# Altium schematic sheet SchematicEdwarda.SchDoc
size A4
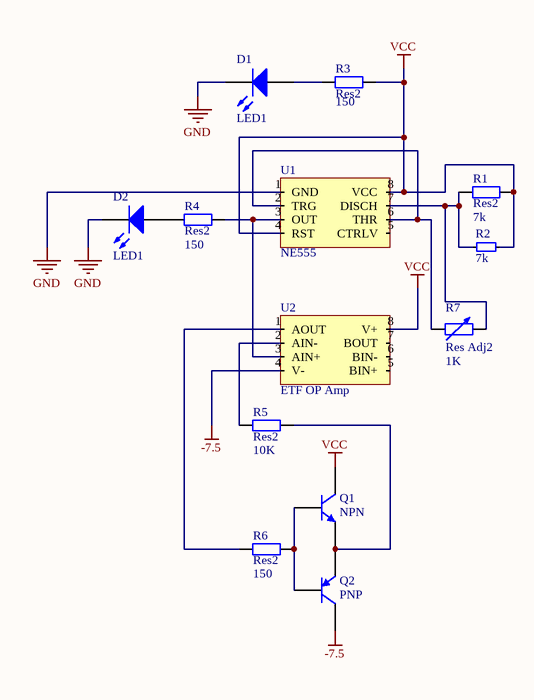
[diagram p0: SchematicEdwarda.SchDoc]

## Parts
D1  LED1  [LED-1]
D2  LED1  [LED-1]
Q1  NPN  [TO-226-AA]
Q2  PNP  [SOT-23B_N]
R1  Res2  value 7k  [AXIAL-0.4]
R2  value 7k  [0603]  (hidden comment: 0402, resistor)
R3  Res2  value 150  [AXIAL-0.4]
R4  Res2  value 150  [AXIAL-0.4]
R5  Res2  value 10K  [AXIAL-0.4]
R6  Res2  value 150  [AXIAL-0.4]
R7  Res Adj2  value 1K  [AXIAL-0.6]
U1  NE555  [NE555]
U2  ETF OP Amp  [NE555]

## Nets
-7.5: Q2.1(C) U2.4(V-)
GND: D1.2(K) D2.2(K) U1.1(GND)
VCC: Q1.1(C) R1.2 R2.0 R3.2 U1.4(RST) U1.8(VCC) U2.8(V+)
NetD1_1: D1.1(A) R3.1
NetD2_1: D2.1(A) R4.1
NetQ1_2: Q1.2(B) Q2.2(B) R6.2
NetQ1_3: Q1.3(E) Q2.3(E) R5.2
NetR1_1: R1.1 R2.1 R7.2 U1.7(DISCH)
NetR4_2: R4.2 U1.3(OUT) U2.3(AIN+)
NetR5_1: R5.1 U2.2(AIN-)
NetR6_1: R6.1 U2.1(AOUT)
NetR7_1: R7.1 U1.2(TRG) U1.6(THR)

Not connected (* = marked no-connect by the designer): U1 5(CTRLV); U2 5(BIN+) 6(BIN-) 7(BOUT)

## Library data of the parts
D1 D2 = LED1: Typical RED GaAs LED; Published: 8-Jun-2000; LatestRevisionDate: 08-Jul-2005; LatestRevisionNote: Mech Layer 1 removed.; PackageReference: LED-1; Publisher: Altium Limited; PackageDescription: LED; 2 Leads
Q1 = NPN: NPN Bipolar Transistor; Published: 8-Jun-2000; LatestRevisionDate: 17-Jul-2002; LatestRevisionNote: Re-released for DXP Platform.; PackageReference: TO-226-AA; Publisher: Altium Limited; PackageDescription: TO, Flat Index; 3 In-Line, Axial Leads; Body Dia. 4.8mm; Leads 0.55 x 0.51 mm (max); Code_JEDEC: TO-226-AA
Q2 = PNP: PNP Bipolar Transistor; Published: 8-Jun-2000; LatestRevisionDate: 29-May-2009; LatestRevisionNote: IPC-7351 Footprint Added.; PackageVersion: Aug-1999; PackageReference: SOT-23B; Publisher: Altium Limited; PackageDescription: 3-Pin SOT-23 Package 0.95 mm Pitch, 2.4 mm Lead Span
R1 R3-R6 = Res2: Resistor; Published: 8-Jun-2000; LatestRevisionDate: 17-Jul-2002; LatestRevisionNote: Re-released for DXP Platform.; PackageReference: AXIAL-0.4; Publisher: Altium Limited; PackageDescription: Axial Device, Thru-Hole; 2 Leads; 0.4 in Pin Spacing
R7 = Res Adj2: Variable Resistor; Set Position: 0.5; Published: 8-Jun-2000; LatestRevisionDate: 17-Jul-2002; LatestRevisionNote: Re-released for DXP Platform.; PackageReference: AXIAL-0.6; Publisher: Altium Limited; PackageDescription: Axial Device, Thru-Hole; 2 Leads; 0.6 in Pin Spacing
U2 = TL082CP